# Altium schematic sheet ID-Serial.SchDoc: Jetson Xavier NX Board
size A3; PageSetup: Record=PageOptions|CenterHorizontal=True|CenterVertical=True|PrintScale=0.97|XCorrection=1.00|YCorrection=1.00|PrintKind=1|BorderSize=5000000|LeftOffset=0|BottomOffset=0|Orientation=2|PaperLength=2970|PaperWidth=2100|Scale=100|PaperSource=7|PrintQuality=600|MediaType=1|DitherType=10|PaperKind=A4|PrintScaleMode=1; Organization: Altium Limited; Address1: 3 Minna Close; Address2: Belrose; Address3: NSW 2085; Address4: Australia; Revision: Rev01
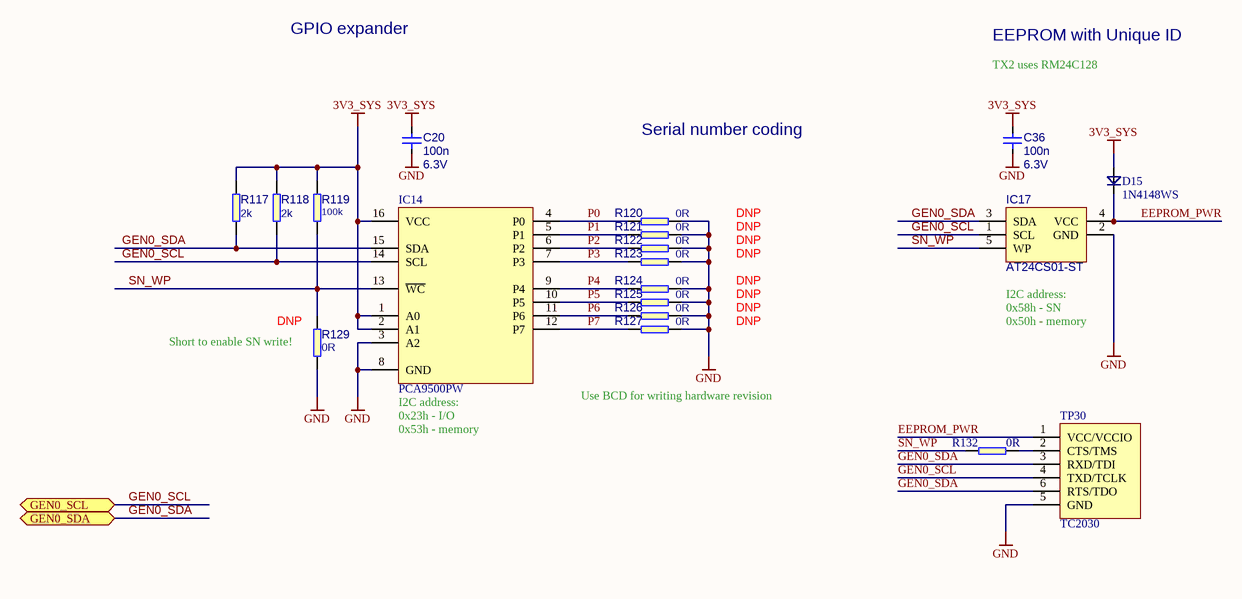
[diagram p0: ID-Serial.SchDoc]

## Parts
C20  Voltage: 6.3V  [0402]  (hidden comment: 100n)
C36  Voltage: 6.3V  [0402]  (hidden comment: 100n)
D15  1N4148WS  [SOD-323]
IC14  PCA9500PW  [TSSOP-16]
IC17  AT24CS01-ST  [SOT23-5]
R117  2k  [0402]
R118  2k  [0402]
R119  100k  [0402]
R120  0R  [0402]
R121  0R  [0402]
R122  0R  [0402]
R123  0R  [0402]
R124  0R  [0402]
R125  0R  [0402]
R126  0R  [0402]
R127  0R  [0402]
R129  0R  [0402]
R132  0R  [0402]
TP30  TC2030  [TC2030]  (no BOM)

## Ports
GEN0_SCL, GEN0_SDA

## Nets
3V3_SYS: C20.2 C36.2 D15.A IC14.1(A0) IC14.2(A1) IC14.16(VCC) R117.1 R118.1 R119.1
GND: C20.1 C36.1 IC14.3(A2) IC14.8(GND) IC17.2(GND) R120.2 R121.2 R122.2 R123.2 R124.2 R125.2 R126.2 R127.2 R129.1 TP30.5(GND)
EEPROM_PWR: D15.C IC17.4(VCC) TP30.1(VCC/VCCIO)
GEN0_SCL: IC14.14(SCL) IC17.1(SCL) R118.2 TP30.4(TXD/TCLK) ; port GEN0_SCL
GEN0_SDA: IC14.15(SDA) IC17.3(SDA) R117.2 TP30.3(RXD/TDI) TP30.6(RTS/TDO) ; port GEN0_SDA
P0: IC14.4(P0) R120.1
P1: IC14.5(P1) R121.1
P2: IC14.6(P2) R122.1
P3: IC14.7(P3) R123.1
P4: IC14.9(P4) R124.1
P5: IC14.10(P5) R125.1
P6: IC14.11(P6) R126.1
P7: IC14.12(P7) R127.1
SN_WP: IC14.13(~{WC}) IC17.5(WP) R119.2 R129.2 R132.1
NetR132_2: R132.2 TP30.2(CTS/TMS)

## Notes on the sheet
- GPIO expander
- EEPROM with Unique ID
- TX2 uses RM24C128
- Serial number coding
- DNP
- (near IC17) I2C address:
- (near R129) Short to enable SN write!
- (near R129) DNP
- 0x58h - SN
- 0x50h - memory
- (near IC14) 0x23h - I/O
- (near IC14) I2C address:
- 0x53h - memory
- Use BCD for writing hardware revision
- Title
- Size:
- Date:
- A3
- Number:
- Time:
- Revision:
- Sheet
- of
- Go360.io
- File:

## Library data of the parts
C20 C36 = C_100n_0402: MLCC SMT Capacitor 100n 0402; Manufacturer: TDK; PartSymbol: C1005X5R0J104K050BA; Value: 100n; PartNumber: C_100n_0402
D15 = diode: Diode small signal; Manufacturer: ON SEMICONDUCTOR; PartNumber: 1N4148WS; Value: 1N4148WS; PartSymbol: 1N4148WS
IC14 = PCA9500PW: Remote 8bit I2C SMBus I/O expander w/ 2kbit EEPROM memory; Manufacturer: NXP Semicondutors; PartNumber: PCA9500PW; Value: PCA9500PW; PartSymbol: PCA9500PW
IC17 = AT24CS01: Manufacturer: Atmel; PartNumber: AT24CS01-ST; PartSymbol: AT24CS01-ST; Value: AT24CS01-ST
R117 R118 = R_2k_0402: RES, 2k, 0402; Manufacturer: VISHAY; PartSymbol: CRCW04022K00FKED; PartNumber: R_2k_0402; Value: 2k
R119 = R_100k_0402: SMT Resistor 100k 0402; Manufacturer: VISHAY; PartSymbol: CRCW0402100KFKEDHP; Tolerance: 1%; PartNumber: R_100k_0402; Value: 100k
R120-R127 R129 R132 = R_0R_0402: RES, 0R, 0402; Manufacturer: Panasonic; PartSymbol: ERJ2GE0R00X; PartNumber: R_0R_0402; Value: 0R
TP30 = TC2030: Manufacturer: Tag-Connect; PartNumber: TC2030; PartSymbol: TC2030; Value: TC2030